# EAGLE schematic DIYTIL311_v0 (EAGLE 9.4.2)
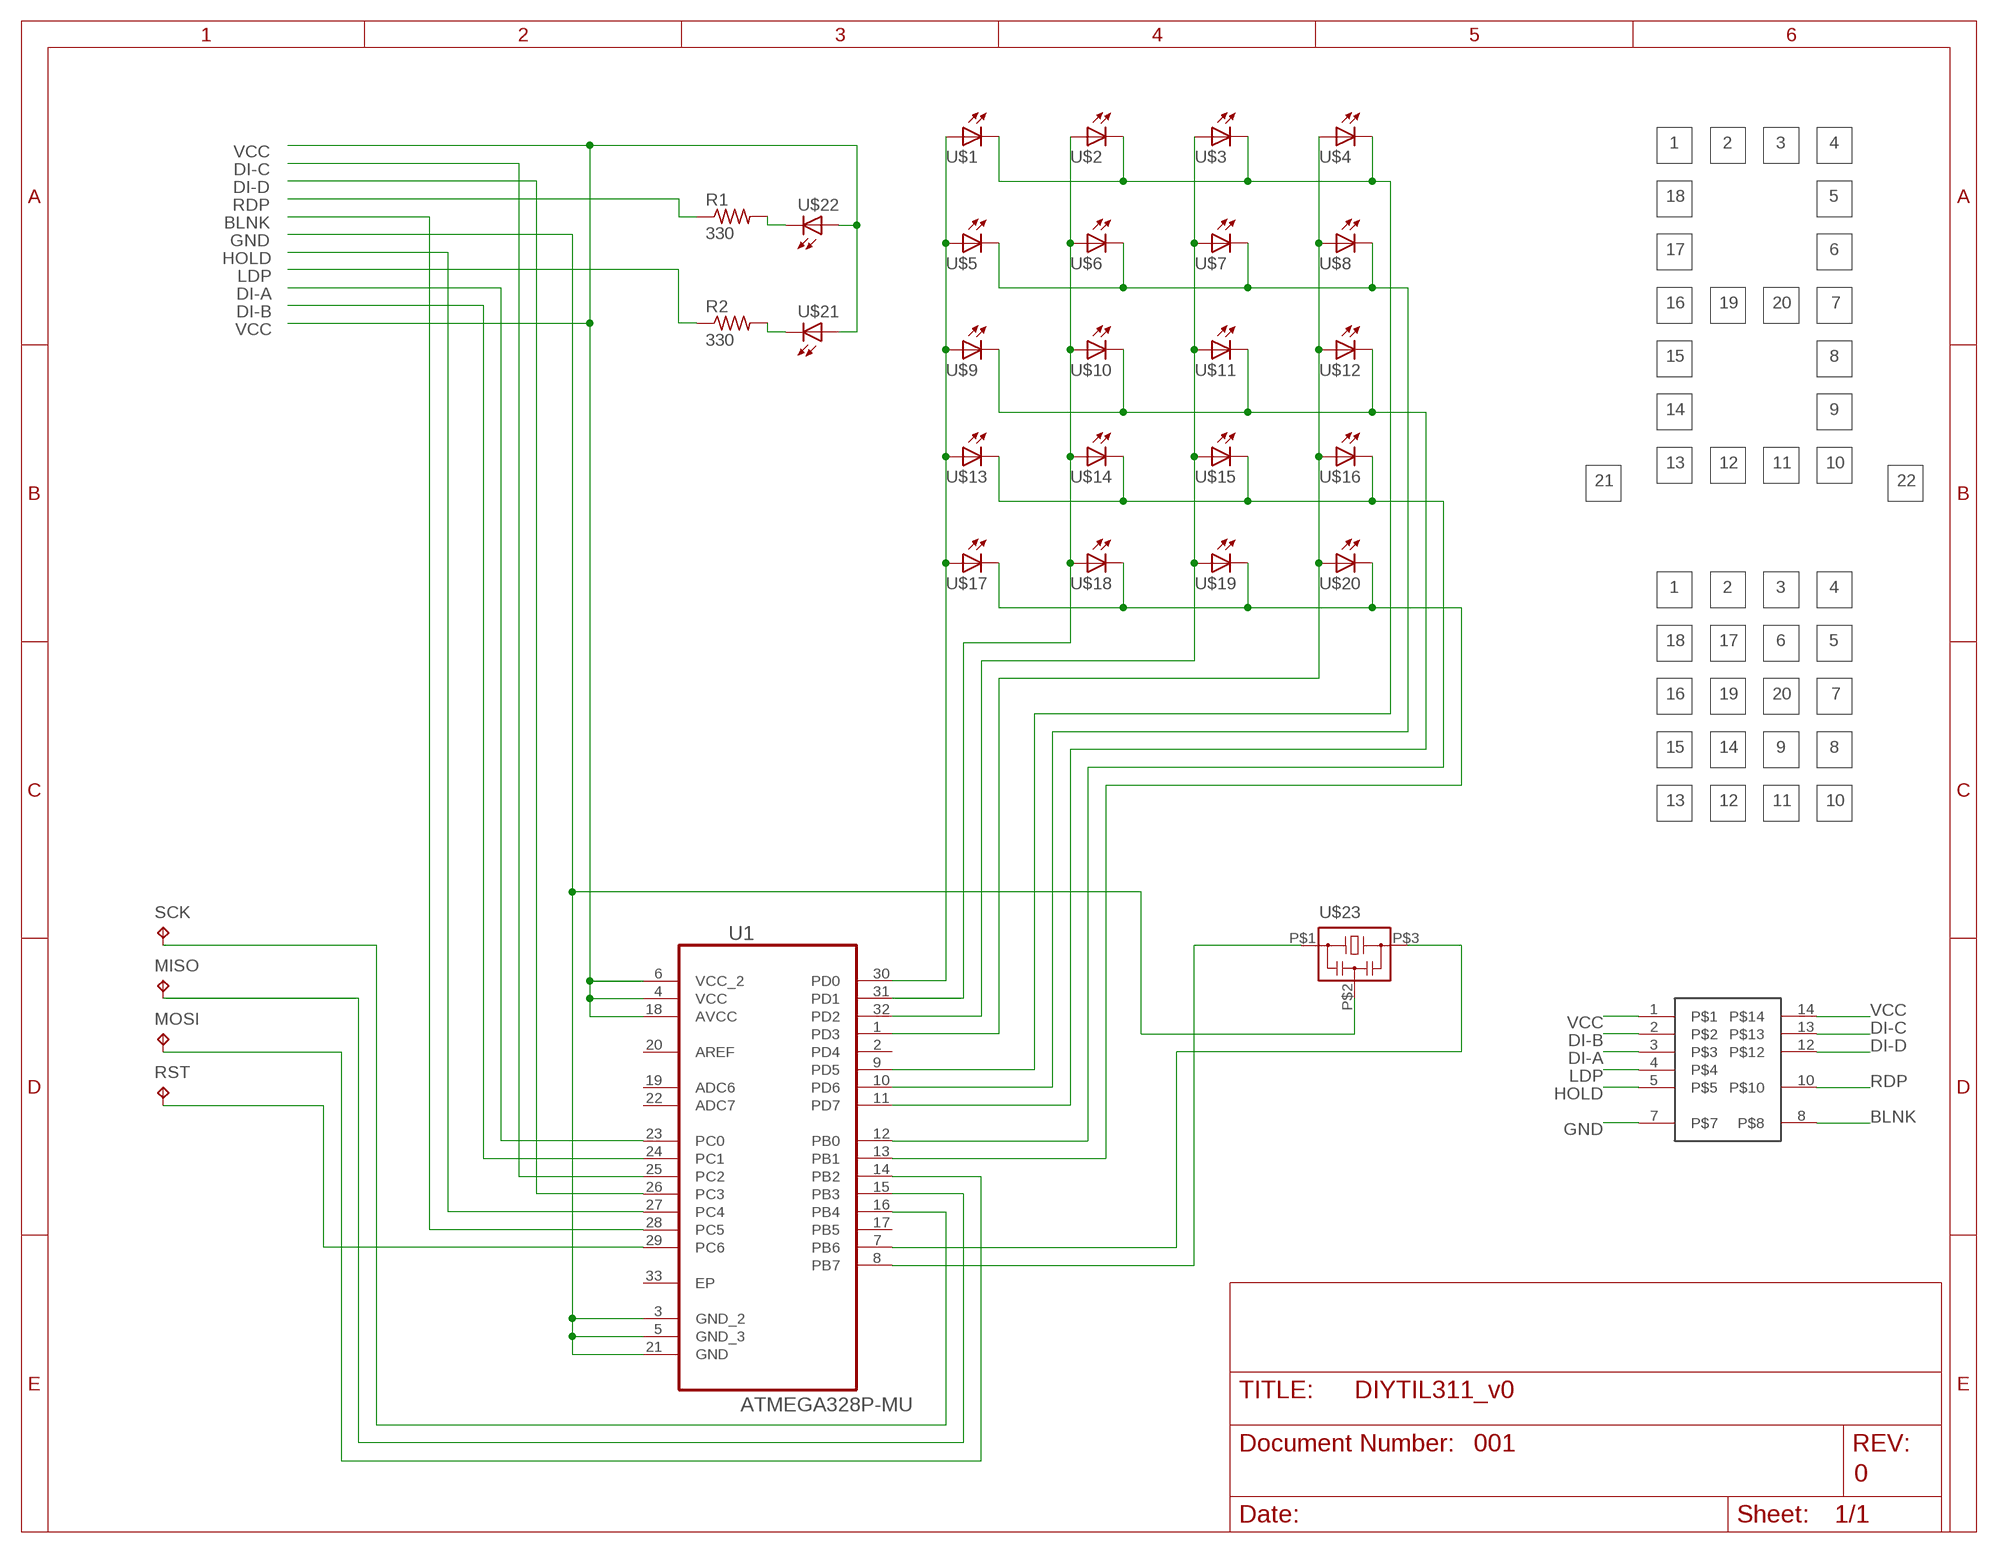
[diagram p0: schematic, sheet 1]

## Parts
MISO  TPB1,27  [B1,27]
MOSI  TPB1,27  [B1,27]
R1  330  R-US_R0201  [R0201]
R2  330  R-US_R0201  [R0201]
RST  TPB1,27  [B1,27]
SCK  TPB1,27  [B1,27]
U1  ATMEGA328P-MU  [QFN50P500X500X100-33N]
U$1  0201.LED0201  [LEDC0603X33]
U$2  0201.LED0201  [LEDC0603X33]
U$3  0201.LED0201  [LEDC0603X33]
U$4  0201.LED0201  [LEDC0603X33]
U$5  0201.LED0201  [LEDC0603X33]
U$6  0201.LED0201  [LEDC0603X33]
U$7  0201.LED0201  [LEDC0603X33]
U$8  0201.LED0201  [LEDC0603X33]
U$9  0201.LED0201  [LEDC0603X33]
U$10  0201.LED0201  [LEDC0603X33]
U$11  0201.LED0201  [LEDC0603X33]
U$12  0201.LED0201  [LEDC0603X33]
U$13  0201.LED0201  [LEDC0603X33]
U$14  0201.LED0201  [LEDC0603X33]
U$15  0201.LED0201  [LEDC0603X33]
U$16  0201.LED0201  [LEDC0603X33]
U$17  0201.LED0201  [LEDC0603X33]
U$18  0201.LED0201  [LEDC0603X33]
U$19  0201.LED0201  [LEDC0603X33]
U$20  0201.LED0201  [LEDC0603X33]
U$21  0201.LED0201  [LEDC0603X33]
U$22  0201.LED0201  [LEDC0603X33]
U$23  CSTNE16M0V53Z000R0  [MFF]
U$24  TIL311DIP  [TIL311DIP_FOOTPRINT]

## Nets
BLNK: U1.28(PC5) U$24.8
DI-A: U1.23(PC0) U$24.3
DI-B: U1.24(PC1) U$24.2
DI-C: U1.25(PC2) U$24.13
DI-D: U1.26(PC3) U$24.12
GND: U1.3(GND_2) U1.5(GND_3) U1.21(GND) U$23.P$2 U$24.7
HOLD: U1.27(PC4) U$24.5
LDP: R2.1 U$24.4
N$1: R1.2 U$22.2(C)
N$2: R2.2 U$21.2(C)
N$3: U1.30(PD0) U$1.1(A) U$5.1(A) U$9.1(A) U$13.1(A) U$17.1(A)
N$4: U1.31(PD1) U$2.1(A) U$6.1(A) U$10.1(A) U$14.1(A) U$18.1(A)
N$5: U1.32(PD2) U$3.1(A) U$7.1(A) U$11.1(A) U$15.1(A) U$19.1(A)
N$6: U1.1(PD3) U$4.1(A) U$8.1(A) U$12.1(A) U$16.1(A) U$20.1(A)
N$7: U1.9(PD5) U$1.2(C) U$2.2(C) U$3.2(C) U$4.2(C)
N$8: U1.10(PD6) U$5.2(C) U$6.2(C) U$7.2(C) U$8.2(C)
N$9: U1.11(PD7) U$9.2(C) U$10.2(C) U$11.2(C) U$12.2(C)
N$10: U1.12(PB0) U$13.2(C) U$14.2(C) U$15.2(C) U$16.2(C)
N$11: U1.13(PB1) U$17.2(C) U$18.2(C) U$19.2(C) U$20.2(C)
N$12: SCK.TP U1.16(PB4)
N$13: MISO.TP U1.15(PB3)
N$14: MOSI.TP U1.14(PB2)
N$15: RST.TP U1.29(PC6)
N$18: U1.7(PB6) U$23.P$3
N$19: U1.8(PB7) U$23.P$1
RDP: R1.1 U$24.10
VCC: U1.4(VCC) U1.6(VCC_2) U1.18(AVCC) U$21.1(A) U$22.1(A) U$24.1 U$24.14
Unconnected: U1.2(PD4) U1.17(PB5) U1.19(ADC6) U1.20(AREF) U1.22(ADC7) U1.33(EP)

## Notes on the sheet
- 1 | 2 | 3 | 4
- 18 | 5
- 17 | 6
- 16 | 19 | 20 | 7
- 15 | 8
- 14 | 9
- 13 | 12 | 11 | 10
- 21 | 22
- 1 | 2 | 3 | 4
- 18 | 17 | 6 | 5
- 16 | 19 | 20 | 7
- 15 | 14 | 9 | 8
- 13 | 12 | 11 | 10
- 001
- 0

## Library data of the parts
MISO MOSI RST SCK = testpad:TP: Test pad
R1 R2 = rcl:R-US_: RESISTOR, American symbol; SPICEPREFIX: R
U1 = Atmel_By_element14_Batch_1-00:ATMEGA328P-MU: Programmable Flash; MPN: ATMEGA328P-MU; OC_FARNELL: 1748522; OC_NEWARK: 26R2526; PACKAGE: QFN-32; SUPPLIER: Atmel
U$1-U$22 = FUCK,_no_one_makes_is_so_I_might_as_well...:0201.LED: No one made a 0201 smd LED, so I made one.
U$23 = FUCK,_no_one_makes_is_so_I_might_as_well...:CSTNE16M0V53Z000R0
U$24 = FUCK,_no_one_makes_is_so_I_might_as_well...:TIL311DIP

## Net classes
0 default: clearance 0.205 mm